# Altium schematic sheet PowerBar.SchDoc: Power Bar
size 381 x 193 mm; Author: Staok; DrawnBy: Staok; Revision: 3.14
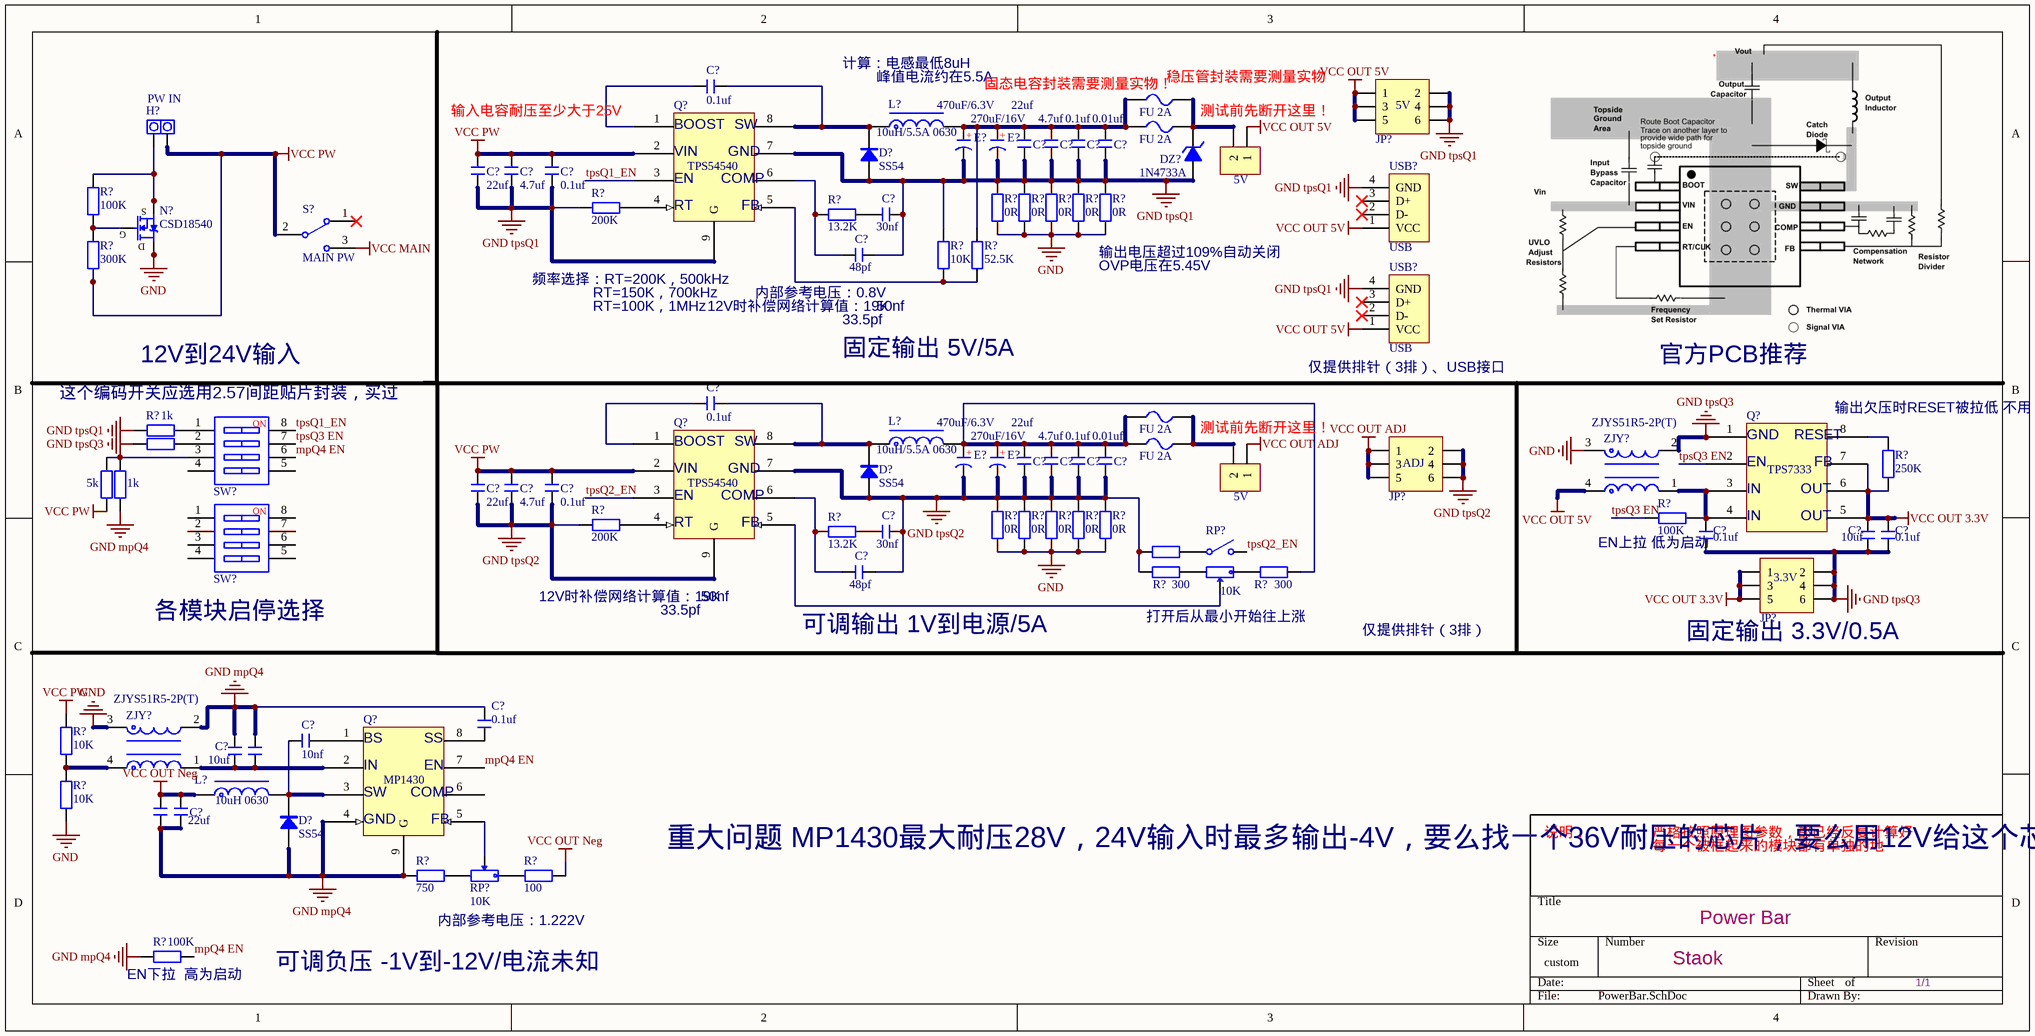
[diagram p0: PowerBar.SchDoc]

## Parts
(Parts that share a designator on the sheet are numbered #1, #2 ... from top to bottom, then left to right.)
C?#1  0.1uf  [C 0805_L]
C?#2  22uf  [C 0805_L]
C?#3  4.7uf  [C 0805_L]
C?#4  0.1uf  [C 0805_L]
C?#5  0.01uf  [C 0805_L]
C?#6  22uf  [C 0805_L]
C?#7  4.7uf  [C 0805_L]
C?#8  0.1uf  [C 0805_L]
C?#9  30nf  [C 0805_L]
C?#10  48pf  [C 0805_L]
C?#11  0.1uf  [C 0805_L]
C?#12  22uf  [C 0805_L]
C?#13  4.7uf  [C 0805_L]
C?#14  0.1uf  [C 0805_L]
C?#15  0.01uf  [C 0805_L]
C?#16  22uf  [C 0805_L]
C?#17  4.7uf  [C 0805_L]
C?#18  0.1uf  [C 0805_L]
C?#19  30nf  [C 0805_L]
C?#20  0.1uf  [C 0805_L]
C?#21  10uf  [C 0805_L]
C?#22  0.1uf  [C 0805_L]
C?#23  48pf  [C 0805_L]
C?#24  10nf  [C 0805_L]
C?#25  0.1uf  [C 0805_L]
C?#26  10uf  [C 0805_L]
C?#27  10uf  [C 0805_L]  (value not drawn)
C?#28  22uf  [C 0805_L]  (value not drawn)
C?#29  22uf  [C 0805_L]
D?#1  SS54  [SMA]
D?#2  SS54  [SMA]
D?#3  SS54  [SMA]
DZ?  1N4733A  [DO-35]
E?#1  470uF/6.3V  [CS 2.5*6.3*11 - C]
E?#2  270uF/16V  [CS 3.5*8*11.5 - C]
E?#3  470uF/6.3V  [CS 2.5*6.3*11 - C]
E?#4  270uF/16V  [CS 3.5*8*11.5 - C]
F?#1  FU 2A  [FU 1812]
F?#2  FU 2A  [FU 1812]
F?#3  FU 2A  [FU 1812]
F?#4  FU 2A  [FU 1812]
H?  PW IN  [T Head]
JP?#1  5V  [HDR2.54-LI-2x3P]
JP?#2  5V  [HDR2.54-LI-2P]
JP?#3  5V  [HDR2.54-LI-2P]
JP?#4  ADJ  [HDR2.54-LI-2x3P]
JP?#5  3.3V  [HDR2.54-LI-2x3P]
L?#1  10uH/5.5A 0630  [L-SMD-0630]
L?#2  10uH/5.5A 0630  [L-SMD-0630]
L?#3  10uH 0630  [L-SMD-0630]
N?  CSD18540  [Q5B]
Q?#1  TPS54540  [ESOP8_M]
Q?#2  TPS7333  [SOP8_N]
Q?#3  TPS54540  [ESOP8_M]
Q?#4  MP1430  [ESOP8_N]
R?#1  200K  [R 0805_L]
R?#2  13.2K  [R 0805_L]
R?#3  100K  [R 0805_L]
R?#4  10K  [R 0805_L]
R?#5  52.5K  [R 0805_L]
R?#6  0R  [R 0805_L]
R?#7  0R  [R 0805_L]
R?#8  0R  [R 0805_L]
R?#9  0R  [R 0805_L]
R?#10  0R  [R 0805_L]
R?#11  300K  [R 0805_L]
R?#12  1k  [R 0805_L]
R?#13  1k  [R 0805_L]  (value not drawn)
R?#14  5k  [R 0805_L]
R?#15  250K  [R 0805_L]
R?#16  1k  [R 0805_L]
R?#17  100K  [R 0805_L]
R?#18  200K  [R 0805_L]
R?#19  13.2K  [R 0805_L]
R?#20  0R  [R 0805_L]
R?#21  0R  [R 0805_L]
R?#22  0R  [R 0805_L]
R?#23  0R  [R 0805_L]
R?#24  0R  [R 0805_L]
R?#25  100  [R 0805_L]  (value not drawn)
R?#26  300  [R 0805_L]
R?#27  300  [R 0805_L]
R?#28  10K  [R 0805_L]
R?#29  10K  [R 0805_L]
R?#30  750  [R 0805_L]
R?#31  100  [R 0805_L]
R?#32  100K  [R 0805_L]
RP?#1  10K  [RV097-K-1-G15]
RP?#2  10K  [RV097-1-G15]
S?  MAIN PW  [MTS-10x]
SW?#1  CSW-4P  [CSW1.27 SMD-4P]  (value not drawn)
SW?#2  CSW-4P  [CSW1.27 SMD-4P]  (value not drawn)
USB?#1  USB  [USB-A/S_A]
USB?#2  USB  [USB-A/S_A]
ZJY?#1  ZJYS51R5-2P(T)  [ZJYS51R5-2P(T)]
ZJY?#2  ZJYS51R5-2P(T)  [ZJYS51R5-2P(T)]

## Nets
GND: N?.5(D) N?.6(D) N?.7(D) N?.8(D) R?#6.1 R?#7.1 R?#8.1 R?#9.1 R?#10.1 R?#20.1 R?#21.1 R?#22.1 R?#23.1 R?#24.1 R?#29.2 ZJY?#1.3 ZJY?#2.3
GND mpQ4: C?#25.2 C?#26.2 C?#27.2 C?#28.1 C?#29.1 D?#3.1(A) Q?#4.4 Q?#4.9(G) R?#16.1 R?#30.2 R?#32.2 ZJY?#2.2
GND tpsQ1: C?#2.1 C?#3.1 C?#4.1 C?#5.1 C?#6.1 C?#7.1 C?#8.1 C?#9.1 C?#10.1 D?#1.1(A) DZ?.1(A) E?#1.2(K) E?#2.2(K) JP?#1.2 JP?#1.4 JP?#1.6 Q?#1.7 Q?#1.9(G) R?#1.2 R?#4.1 R?#6.2 R?#7.2 R?#8.2 R?#9.2 R?#10.2 R?#12.2 USB?#1.4(GND) USB?#2.4(GND)
GND tpsQ2: C?#12.1 C?#13.1 C?#14.1 C?#15.1 C?#16.1 C?#17.1 C?#18.1 C?#19.1 C?#23.1 D?#2.1(A) E?#3.2(K) E?#4.2(K) JP?#4.2 JP?#4.4 JP?#4.6 Q?#3.7 Q?#3.9(G) R?#18.2 R?#20.2 R?#21.2 R?#22.2 R?#23.2 R?#24.2 R?#25.2 R?#26.2
GND tpsQ3: C?#20.1 C?#21.1 C?#22.1 JP?#5.2 JP?#5.4 JP?#5.6 Q?#2.1 R?#13.2 ZJY?#1.2
VCC MAIN: S?.3
VCC OUT 3.3V: C?#21.2 C?#22.2 JP?#5.1 JP?#5.3 JP?#5.5 Q?#2.5 Q?#2.6 Q?#2.7 R?#15.1
VCC OUT 5V: JP?#1.1 JP?#1.3 JP?#1.5 JP?#2.1 USB?#1.1(VCC) USB?#2.1(VCC) ZJY?#1.4
VCC OUT ADJ: JP?#3.1 JP?#4.1 JP?#4.3 JP?#4.5
VCC OUT Neg: C?#28.2 C?#29.2 L?#3.1 R?#31.1
VCC PW: C?#6.2 C?#7.2 C?#8.2 C?#16.2 C?#17.2 C?#18.2 H?.2 Q?#1.2 Q?#3.2 R?#11.1 R?#14.2 R?#28.1 S?.2
mpQ4 EN: Q?#4.7 R?#32.1 SW?#1.6
tpsQ1_EN: Q?#1.3 SW?#1.8
tpsQ2_EN: Q?#3.3 RP?#1.4
tpsQ3 EN: Q?#2.2 R?#17.2 SW?#1.7
NetC?#1_1: C?#1.1 D?#1.2(K) L?#1.1 Q?#1.8
NetC?#1_2: C?#1.2 Q?#1.1
NetC?#2_2: C?#2.2 C?#3.2 C?#4.2 C?#5.2 E?#1.1(A) E?#2.1(A) F?#1.1 F?#2.1 L?#1.2 R?#5.1
NetC?#9_2: C?#9.2 R?#2.1
NetC?#10_2: C?#10.2 Q?#1.6 R?#2.2
NetC?#11_1: C?#11.1 D?#2.2(K) L?#2.1 Q?#3.8
NetC?#11_2: C?#11.2 Q?#3.1
NetC?#12_2: C?#12.2 C?#13.2 C?#14.2 C?#15.2 E?#3.1(A) E?#4.1(A) F?#3.1 F?#4.1 L?#2.2 R?#27.2
NetC?#19_2: C?#19.2 R?#19.1
NetC?#20_2: C?#20.2 Q?#2.3 Q?#2.4 R?#17.1 ZJY?#1.1
NetC?#23_2: C?#23.2 Q?#3.6 R?#19.2
NetC?#24_1: C?#24.1 D?#3.2(K) L?#3.2 Q?#4.3
NetC?#24_2: C?#24.2 Q?#4.1
NetC?#25_1: C?#25.1 Q?#4.8
NetC?#26_1: C?#26.1 C?#27.1 Q?#4.2 ZJY?#2.1
NetDZ?_2: DZ?.2(K) F?#1.2 F?#2.2 JP?#2.2
NetF?#3_2: F?#3.2 F?#4.2 JP?#3.2
NetH?_1: H?.1 N?.1(S) N?.2(S) N?.3(S) R?#3.2
NetN?_4: N?.4(G) R?#3.1 R?#11.2
NetQ?#1_4: Q?#1.4 R?#1.1
NetQ?#1_5: Q?#1.5 R?#4.2 R?#5.2
NetQ?#2_8: Q?#2.8 R?#15.2
NetQ?#3_4: Q?#3.4 R?#18.1
NetQ?#3_5: Q?#3.5 RP?#1.2
NetQ?#4_5: Q?#4.5 RP?#2.2
NetR?#12_1: R?#12.1 SW?#1.1
NetR?#13_1: R?#13.1 SW?#1.2
NetR?#14_1: R?#14.1 R?#16.2 SW?#1.3
NetR?#25_1: R?#25.1 RP?#1.5
NetR?#26_1: R?#26.1 RP?#1.3
NetR?#27_1: R?#27.1 RP?#1.1
NetR?#28_2: R?#28.2 R?#29.1 ZJY?#2.4
NetR?#30_1: R?#30.1 RP?#2.3
NetR?#31_2: R?#31.2 RP?#2.1

Not connected (* = marked no-connect by the designer): Q?#4 6; S? 1*; SW?#1 4 5; SW?#2 1 2 3 4 5 6 7 8; USB?#1 2(D-)* 3(D+)*; USB?#2 2(D-)* 3(D+)*

## Notes on the sheet
- (near C?#6) 输入电容耐压至少大于25V
- 计算：电感最低8uH
- 峰值电流约在5.5A
- (near C?#2) 固态电容封装需要测量实物！
- (near F?#1) 稳压管封装需要测量实物
- 测试前先断开这里！
- (near Q?#1) BOOST
- (near Q?#1) VIN
- (near Q?#1) GND
- (near Q?#1) SW
- (near Q?#1) EN
- (near Q?#1) RT
- (near Q?#1) COMP
- (near Q?#1) FB
- 频率选择：RT=200K，500kHz
- RT=150K，700kHz
- RT=100K，1MHz
- 12V时补偿网络计算值：19K
- (near C?#10) 内部参考电压：0.8V
- 50nf
- (near R?#10) 输出电压超过109%自动关闭
- (near R?#10) OVP电压在5.45V
- 12V到24V输入
- 33.5pf
- 固定输出 5V/5A
- (near USB?#2) 仅提供排针（3排）、USB接口
- 官方PCB推荐
- 这个编码开关应选用2.57间距贴片封装，买过
- (near Q?#3) BOOST
- (near Q?#3) SW
- (near Q?#2) GND
- (near Q?#2) RESET
- 输出欠压时RESET被拉低 不用
- (near Q?#3) VIN
- (near Q?#3) EN
- (near Q?#3) COMP
- (near Q?#3) GND
- (near Q?#2) EN
- (near Q?#2) IN
- (near Q?#2) OUT
- (near Q?#2) FB
- (near Q?#3) RT
- (near Q?#3) FB
- (near R?#17) EN上拉 低为启动
- (near SW?#2) 各模块启停选择
- (near Q?#3) 50nf
- (near C?#23) 可调输出 1V到电源/5A
- 打开后从最小开始往上涨
- 仅提供排针（3排）
- (near JP?#5) 固定输出 3.3V/0.5A
- (near Q?#4) BS
- (near Q?#4) IN
- (near Q?#4) SS
- (near Q?#4) EN
- (near Q?#4) SW
- (near Q?#4) GND
- (near Q?#4) COMP
- (near Q?#4) FB
- 重大问题 MP1430最大耐压28V，24V输入时最多输出-4V，要么找一个36V耐压的芯片，要么用12V给这个芯片供电，肯定前者！！
- 说明：
- 严格按照原理图参数，都已经反复计算好
- 每一个被框起来的模块都有单独的地
- 内部参考电压：1.222V
- (near R?#32) EN下拉  高为启动
- 可调负压 -1V到-12V/电流未知
- 1/1
- (in symbol C-CS) +
- (in symbol CSW-4P) NO

## Library data of the parts
C?#1-C?#29 = C: 无极性贴片电容; 版权归属: 源创客; 材质: X7R; BOM名称: 无极性贴片电容; 学习资源: www.ooocke.com
D?#1-D?#3 = SS54: 肖特基二极管; 版权归属: 源创客; 属性: 40V/3A; BOM名称: 肖特基二极管; 学习资源: www.ooocke.com
DZ? = 1N4620: 3.3V/0.5W稳压管; 版权归属: 源创客; BOM名称: 3.3V/0.5W稳压管; 学习资源: www.ooocke.com
E?#1-E?#4 = C-CS: 直插固态电容; 版权归属: 源创客; BOM名称: 直插固态电容; 学习资源: www.ooocke.com
F?#1-F?#4 = FU: 贴片保险丝; 版权归属: 源创客; BOM名称: 贴片保险丝; 学习资源: www.ooocke.com
H? = PAD2: 引线焊盘; 版权归属: 源创客; BOM名称: 引线焊盘; 学习资源: www.ooocke.com
JP?#1 JP?#4 JP?#5 = Header 3X2: 3*2P接插件; 版权归属: 源创客; BOM名称: 3*2P接插件; 学习资源: www.ooocke.com
JP?#2 JP?#3 = Header 2: 2P接插件; 版权归属: 源创客; BOM名称: 2P接插件; 学习资源: www.ooocke.com
L?#1-L?#3 = L-CD: 贴片功率电感; BOM名称: 功率电感; 版权归属: 源创客; 学习资源: www.ooocke.com
Q?#1 Q?#3 Q?#4 = ESOP8
Q?#2 = 8
R?#1-R?#32 = R: 贴片电阻; 版权归属: 源创客; BOM名称: 贴片电阻; 学习资源: www.ooocke.com
RP?#1 = RP-KEY-ID: 插件单联开关型电位器; BOM名称: 开关型电位器; 版权归属: 源创客; 学习资源: www.ooocke.com
RP?#2 = RP-ID: 插件单联电位器; BOM名称: 插件电位器; 版权归属: 源创客; 学习资源: www.ooocke.com
S? = MTS-10x: MTS10x系列3脚扭子开关; 版权归属: 源创客; BOM名称: MTS10x系列3脚扭子开关; 学习资源: www.ooocke.com
SW?#1 SW?#2 = CSW-4P: 4路编码开关; 版权归属: 源创客; BOM名称: 4路编码开关; 学习资源: www.ooocke.com
USB?#1 USB?#2 = USB-A/S: USB-A型母接口; 版权归属: 源创客; BOM名称: USB-A型母接口; 学习资源: www.ooocke.com